# EAGLE design nahhhhh (EAGLE 9.6.2)
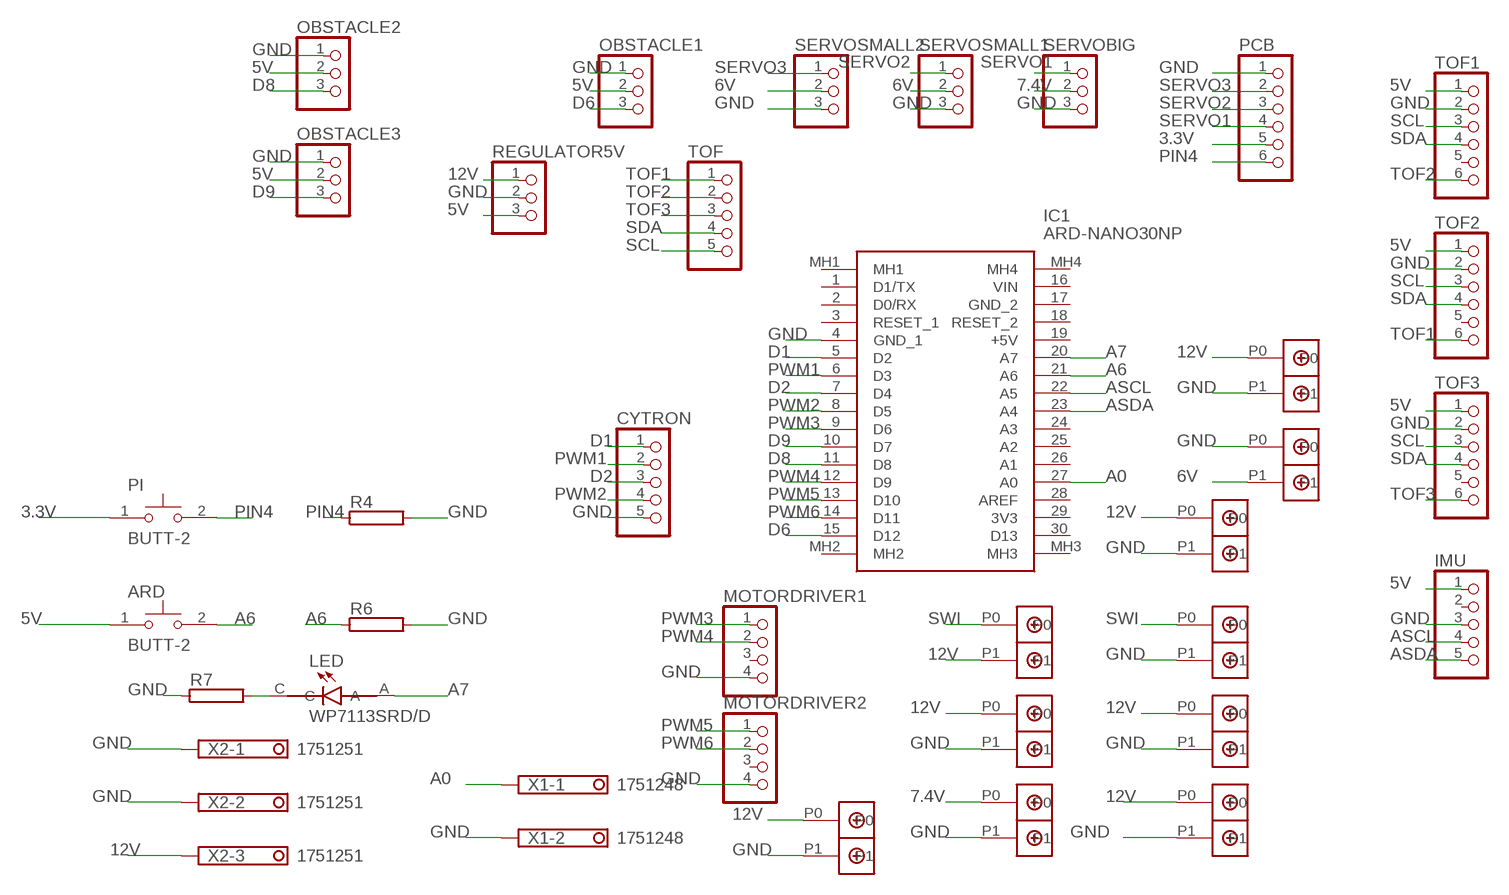
[diagram p0: schematic, sheet 1]

## Parts
ARD  BUTT-2  [SW_BUTT-2]
BATERY  DBCONN-1X2  [DBCONN-1X2]
BUCKSERVO  DBCONN-1X2  [DBCONN-1X2]
CYTRON  PINHD-1X5  [1X05]
CYTRONPOWER  DBCONN-1X2  [DBCONN-1X2]
IC1  ARD-NANO30NP  [ARDNANO30NP]
IMU  PINHD-1X5  [1X05]
LED  WP7113SRD/D  [LED_WP7113SRD/D]
LEDS  DBCONN-1X2  [DBCONN-1X2]
LEDS1  DBCONN-1X2  [DBCONN-1X2]
LEDS2  DBCONN-1X2  [DBCONN-1X2]
LEDS3  DBCONN-1X2  [DBCONN-1X2]
LEDS4  DBCONN-1X2  [DBCONN-1X2]
LEDS5  DBCONN-1X2  [DBCONN-1X2]
MOTORDRIVER1  PINHD-1X4  [1X04]
MOTORDRIVER2  PINHD-1X4  [1X04]
OBSTACLE1  PINHD-1X3  [1X03]
OBSTACLE2  PINHD-1X3  [1X03]
OBSTACLE3  PINHD-1X3  [1X03]
PCB  PINHD-1X6  [1X06]
PI  BUTT-2  [SW_BUTT-2]
R4  RHPS58  [HPS58]
R6  RHPS58  [HPS58]
R7  RHPS58  [HPS58]
REGULATOR5V  PINHD-1X3  [1X03]
SERVOBIG  PINHD-1X3  [1X03]
SERVOSMALL1  PINHD-1X3  [1X03]
SERVOSMALL2  PINHD-1X3  [1X03]
TOF  PINHD-1X5  [1X05]
TOF1  PINHD-1X6  [1X06]
TOF2  PINHD-1X6  [1X06]
TOF3  PINHD-1X6  [1X06]
U$1  DBCONN-1X2  [DBCONN-1X2]
X1  1751248  [1751248]
X2  1751251  [1751251]

## Nets
3.3V: PCB.5 PI.1
5V: ARD.1 IMU.1 OBSTACLE1.2 OBSTACLE2.2 OBSTACLE3.2 REGULATOR5V.3 TOF1.1 TOF2.1 TOF3.1
6V: LEDS5.P1 SERVOSMALL1.2 SERVOSMALL2.2
7.4V: SERVOBIG.2 U$1.P0
12V: BUCKSERVO.P0 CYTRONPOWER.P0 LEDS1.P1 LEDS2.P0 LEDS3.P0 LEDS4.P0 LEDS.P0 REGULATOR5V.1 X2.3
A0: IC1.27(A0) X1.1
A6: ARD.2 IC1.21(A6) R6.1
A7: IC1.20(A7) LED.A
ASCL: IC1.22(A5) IMU.4
ASDA: IC1.23(A4) IMU.5
D1: CYTRON.1 IC1.5(D2)
D2: CYTRON.3 IC1.7(D4)
D6: IC1.15(D12) OBSTACLE1.3
D8: IC1.11(D8) OBSTACLE2.3
D9: IC1.10(D7) OBSTACLE3.3
GND: BATERY.P1 BUCKSERVO.P1 CYTRON.5 CYTRONPOWER.P1 IC1.4(GND_1) IMU.3 LEDS2.P1 LEDS3.P1 LEDS4.P1 LEDS5.P0 LEDS.P1 MOTORDRIVER1.4 MOTORDRIVER2.4 OBSTACLE1.1 OBSTACLE2.1 OBSTACLE3.1 PCB.1 R4.2 R6.2 R7.1 REGULATOR5V.2 SERVOBIG.3 SERVOSMALL1.3 SERVOSMALL2.3 TOF1.2 TOF2.2 TOF3.2 U$1.P1 X1.2 X2.1 X2.2
N$2: LED.C R7.2
PIN4: PCB.6 PI.2 R4.1
PWM1: CYTRON.2 IC1.6(D3)
PWM2: CYTRON.4 IC1.8(D5)
PWM3: IC1.9(D6) MOTORDRIVER1.1
PWM4: IC1.12(D9) MOTORDRIVER1.2
PWM5: IC1.13(D10) MOTORDRIVER2.1
PWM6: IC1.14(D11) MOTORDRIVER2.2
SCL: TOF1.3 TOF2.3 TOF3.3 TOF.5
SDA: TOF1.4 TOF2.4 TOF3.4 TOF.4
SERVO1: PCB.4 SERVOBIG.1
SERVO2: PCB.3 SERVOSMALL1.1
SERVO3: PCB.2 SERVOSMALL2.1
SWI: BATERY.P0 LEDS1.P0
TOF1: TOF2.6 TOF.1
TOF2: TOF1.6 TOF.2
TOF3: TOF3.6 TOF.3
Unconnected: IC1.1(D1/TX) IC1.2(D0/RX) IC1.3(RESET_1) IC1.16(VIN) IC1.17(GND_2) IC1.18(RESET_2) IC1.19(+5V) IC1.24(A3) IC1.25(A2) IC1.26(A1) IC1.28(AREF) IC1.29(3V3) IC1.30(D13) IC1.MH1 IC1.MH2 IC1.MH3 IC1.MH4 IMU.2 MOTORDRIVER1.3 MOTORDRIVER2.3 TOF1.5 TOF2.5 TOF3.5

## Library data of the parts
ARD PI = BUTT-2:BUTT-2: Tactile Switches MINI PUSH BUTTON SWITCH 2-PIN QTY. 4 Check availability <https://pricing.snapeda.com/parts/BUTT-2/Gravitech/view-part?ref=eda>; AVAILABILITY: Not in stock; CHECK_PRICES: https://www.snapeda.com/parts/BUTT-2/Gravitech/view-part/?ref=eda; DESCRIPTION: Tactile Switches MINI PUSH BUTTON SWITCH 2-PIN QTY. 4; MF: Gravitech; MP: BUTT-2; PACKAGE: None; PRICE: None; SNAPEDA_LINK: https://www.snapeda.com/parts/BUTT-2/Gravitech/view-part/?ref=snap
BATERY BUCKSERVO CYTRONPOWER LEDS LEDS1-LEDS5 U$1 = Terminal Block Connector:DBCONN-1X2
CYTRON IMU TOF = pinhead:PINHD-1X5: PIN HEADER
IC1 = ARD-NANO30NP:ARD-NANO30NP: Development Boards & Kits - AVR Arduino Nano 3.1 W/ATMEGA328 NO-PIN Source: Datasheet <http://www.mouser.com/datasheet/2/595/Arduino_Nano3_0-220057.pdf>; DESCRIPTION: Development Boards & Kits - AVR Arduino Nano 3.1 W/ATMEGA328 NO-PIN; HEIGHT: 5mm; MANUFACTURER_NAME: Gravitech; MANUFACTURER_PART_NUMBER: ARD-NANO30NP; MOUSER_PART_NUMBER: 992-ARD-NANO30NP; MOUSER_PRICE-STOCK: https://www.mouser.co.uk/ProductDetail/Gravitech/ARD-NANO30NP?qs=Vxac6xGyzPlh7in3DWNTbQ%3D%3D
LED = WP7113SRD_D:WP7113SRD/D: Red T-1 3/4 5 mm 30° Tinted Diffused 600 mcd 1.85 V Solid State LED Through Hole Check availability <https://pricing.snapeda.com/parts/WP7113SRD/D/Kingbright/view-part?ref=eda>; AVAILABILITY: In Stock; CHECK_PRICES: https://www.snapeda.com/parts/WP7113SRD/D/Kingbright/view-part/?ref=eda; DESCRIPTION: Red 640nm LED Indication - Discrete 1.85V Radial; MF: Kingbright; MP: WP7113SRD/D; PACKAGE: Radial Kingbright; PRICE: None; SNAPEDA_LINK: https://www.snapeda.com/parts/WP7113SRD/D/Kingbright/view-part/?ref=snap
MOTORDRIVER1 MOTORDRIVER2 = pinhead:PINHD-1X4: PIN HEADER
OBSTACLE1-OBSTACLE3 REGULATOR5V SERVOBIG SERVOSMALL1 SERVOSMALL2 = pinhead:PINHD-1X3: PIN HEADER
PCB TOF1-TOF3 = pinhead:PINHD-1X6: PIN HEADER
R4 R6 R7 = resistor-power:R: Power Resitor; OC_FARNELL: unknown; OC_NEWARK: unknown
X1 = con-phoenix-350:1751248: MKDS 1/ 2-3,5 Printklemme Nennstrom: 10 A Bemessungsspannung: 160 V Raster: 3,5 mm Polzahl: 2 Montageart: Löten Anschlussart: Schraubanschluss Anschlussrichtung vom Leiter zur Platine: 0° Source: http://eshop.phoenixcontact.com .. 1751248.pdf; OC_FARNELL: unknown; OC_NEWARK: unknown
X2 = con-phoenix-350:1751251: MKDS 1/ 3-3,5 Printklemme Nennstrom: 10 A Bemessungsspannung: 160 V Raster: 3,5 mm Polzahl: 3 Montageart: Löten Anschlussart: Schraubanschluss Anschlussrichtung vom Leiter zur Platine: 0° Source: http://eshop.phoenixcontact.com .. 1751251.pdf; OC_FARNELL: unknown; OC_NEWARK: unknown

## Board
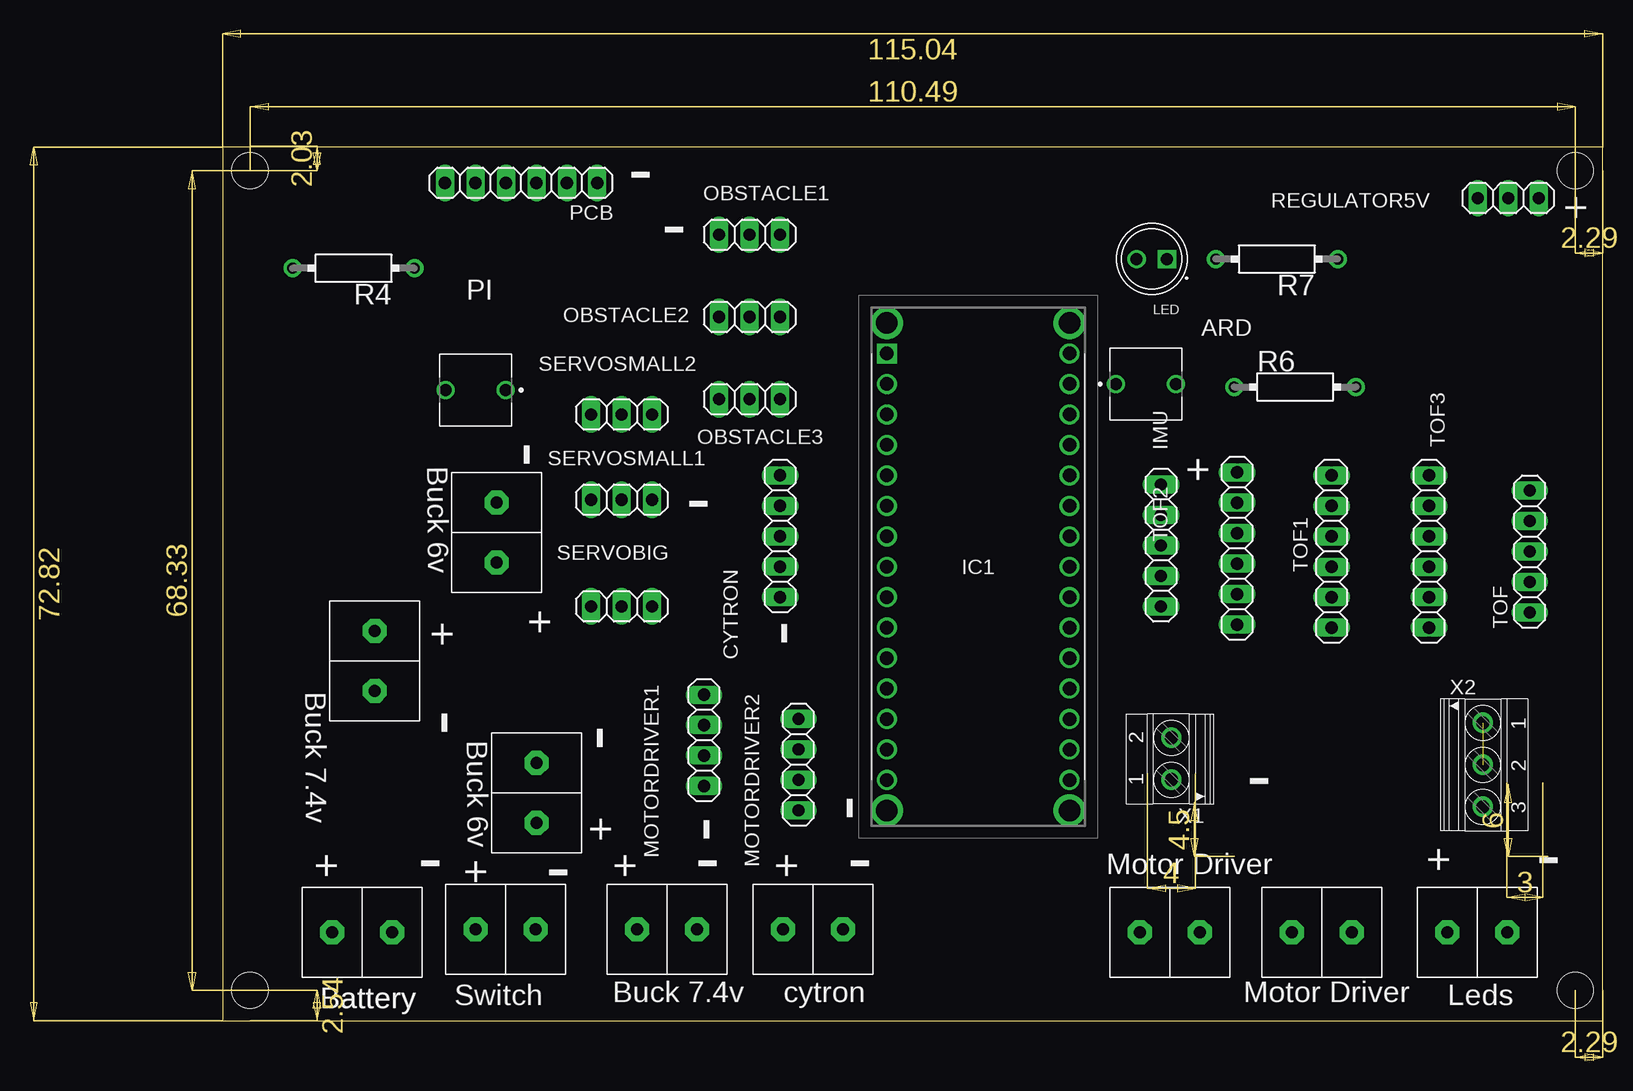
[diagram p1: board, top side]
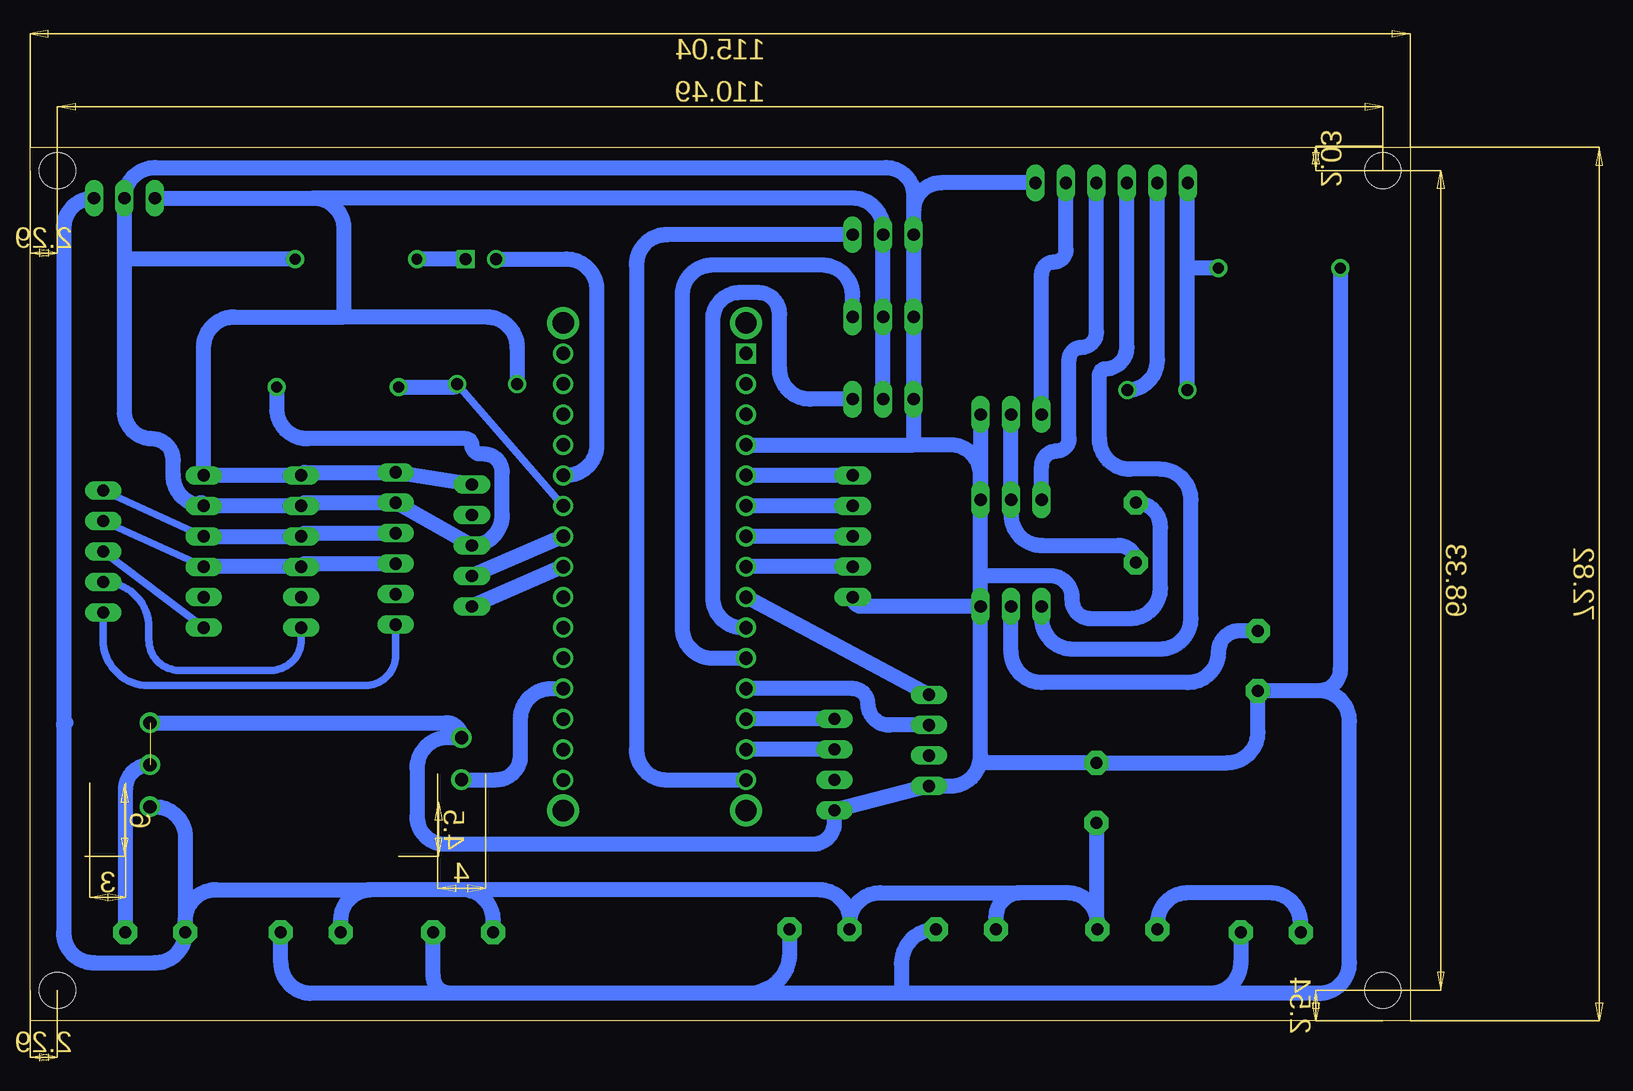
[diagram p2: board, bottom side, seen from below]

Size 115.04 x 72.82 mm. Coordinates in mm from the lower left corner, seen from the top.
Outline: 0,0 115.04,0 115.04,72.82 0,72.82 0,0
Copper layers (1*16): Top 0.035mm / dielectric 1.5mm / Bottom 0.035mm
Design rules "default": minimum track width 6mil, minimum drill 0.35mm, track to track 6mil, track to pad 6mil, pad to pad 6mil, via to via 6mil, smd to smd 6mil, copper to edge 40mil, drill to drill 6mil, minimum pad ring 10mil, minimum via ring 8mil, stop-mask expansion 4mil, vias tented up to drill 0mil, thermal gap 10mil
Holes 3 mm at 112.78,2.54 112.78,70.87 2.29,2.54 2.29,70.87

### Footprints (pad centres in the part's own frame; a part is rotated, then mirrored left to right if it is on the bottom)
SW_BUTT-2 = drill 1: 1 -2.5,0; 2 2.5,0
DBCONN-1X2 = drill 1 pad 2 octagon: P0 -2.54,0; P1 2.46,0
1X05 = drill 1.016 long: 1 -5.08,0; 2 -2.54,0; 3 0,0; 4 2.54,0; 5 5.08,0
ARDNANO30NP = drill 1.11 pad 1.665 square: 1 0,0 | drill 1.11 pad 1.665: 2 0,-2.54; 3 0,-5.08; 4 0,-7.62; 5 0,-10.16; 6 0,-12.7; 7 0,-15.24; 8 0,-17.78; 9 0,-20.32; 10 0,-22.86; 11 0,-25.4; 12 0,-27.94; 13 0,-30.48; 14 0,-33.02; 15 0,-35.56; 16 15.24,0; 17 15.24,-2.54; 18 15.24,-5.08; 19 15.24,-7.62; 20 15.24,-10.16; 21 15.24,-12.7; 22 15.24,-15.24; 23 15.24,-17.78; 24 15.24,-20.32; 25 15.24,-22.86; 26 15.24,-25.4; 27 15.24,-27.94; 28 15.24,-30.48; 29 15.24,-33.02; 30 15.24,-35.56 | drill 1.778 pad 2.667: MH1 0,2.54; MH2 0,-38.1; MH3 15.24,-38.1; MH4 15.24,2.54
LED_WP7113SRD/D = drill 1: A 1.27,0 | drill 1 square: C -1.27,0
1X04 = drill 1.016 long: 1 -3.81,0; 2 -1.27,0; 3 1.27,0; 4 3.81,0
1X03 = drill 1.016 long: 1 -2.54,0; 2 0,0; 3 2.54,0
1X06 = drill 1.016 long: 1 -6.35,0; 2 -3.81,0; 3 -1.27,0; 4 1.27,0; 5 3.81,0; 6 6.35,0
HPS58 = drill 0.9 pad 1.5: 1 -5.08,0; 2 5.08,0
1751248 = drill 1.1 pad 1.7: 1 -1.75,-0.1; 2 1.75,-0.1
1751251 = drill 1.1 pad 1.7: 1 -3.5,-0.1; 2 0,-0.1; 3 3.5,-0.1

### Placement (x,y rotation side)
ARD  76.96,53.09 0 top
BATERY  11.68,7.37 0 top
BUCKSERVO  104.65,7.37 0 top
CYTRON  46.48,40.39 270 top
CYTRONPOWER  49.28,7.62 0 top
IC1  55.37,55.63 0 top
IMU  78.23,39.62 270 top
LED  77.47,63.5 180 top
LEDS  37.08,7.62 0 top
LEDS1  23.62,7.62 0 top
LEDS2  91.69,7.37 0 top
LEDS3  78.99,7.37 0 top
LEDS4  26.16,19.05 90 top
LEDS5  22.86,40.64 270 top
MOTORDRIVER1  40.13,23.37 270 top
MOTORDRIVER2  48.01,21.34 270 top
OBSTACLE1  43.94,65.53 0 top
OBSTACLE2  43.94,58.67 0 top
OBSTACLE3  43.94,51.82 0 top
PCB  24.89,69.85 180 top
PI  21.08,52.58 180 top
R4  10.92,62.74 180 top
R6  89.41,52.83 0 top
R7  87.88,63.5 180 top
REGULATOR5V  107.19,68.58 180 top
SERVOBIG  33.27,34.54 0 top
SERVOSMALL1  33.27,43.43 0 top
SERVOSMALL2  33.27,50.55 0 top
TOF  108.97,39.12 90 top
TOF1  92.46,39.12 270 top
TOF2  84.58,39.37 270 top
TOF3  100.58,39.12 270 top
U$1  12.7,29.97 270 top
X1  78.99,21.84 90 top
X2  105.16,21.34 270 top

### Tracks (layer width: path | path; a pad name or v marks a point on that pad's centre or on a via)
3.3V
  Bottom 1.27: PI.1 arc-90 21.08,55.08 PCB.5
5V
  Bottom 1.27: 88.9,58.67 77,58.67 arc90 74.46,56.13 ARD.1 | REGULATOR5V.3 91.44,68.58 | 91.44,68.58 arc90 88.9,66.04 88.9,58.67 | OBSTACLE3.2 OBSTACLE2.2 OBSTACLE1.2 43.94,66.04 arc-90 46.48,68.58 91.44,68.58 | 88.9,58.67 98.04,58.67 arc-90 100.58,56.13 TOF3.1 TOF1.1 92.2,45.72 TOF2.1 IMU.1
6V
  Bottom 1.27: SERVOSMALL2.2 SERVOSMALL1.2 33.27,42.16 arc-90 30.73,39.62 24.3,39.62 arc90 LEDS5.P1
7.4V
  Bottom 1.27: U$1.P0 14.22,32.51 arc-90 16,30.73 arc90 18.54,28.19 30.73,28.19 arc90 33.27,30.73 SERVOBIG.2
12V
  Bottom 1.27: REGULATOR5V.1 arc-90 112.27,66.04 112.27,24.64 | 112.27,24.64 112.27,7.37 arc-90 109.73,4.83 104.65,4.83 arc-90 BUCKSERVO.P0 | LEDS2.P0 89.15,8.38 arc90 86.61,10.92 | BUCKSERVO.P0 102.11,8.38 arc90 99.57,10.92 86.61,10.92 | 112.07,24.84 arc-90 112.27,24.64 | X2.3 104.65,17.84 arc90 102.11,15.3 BUCKSERVO.P0 | LEDS3.P0 76.45,8.38 arc-90 78.99,10.92 | 78.99,10.92 86.61,10.92 | 78.99,10.92 49.28,10.92 arc90 46.74,8.38 CYTRONPOWER.P0 46.74,8.13 arc90 44.2,10.67 32.51,10.67 | 32.51,10.67 28.62,10.67 arc90 26.08,8.13 LEDS1.P1 arc90 26.16,7.7 LEDS4.P0 | 32.51,10.67 arc-90 34.54,8.64 LEDS.P0
A0
  Bottom 1.27: X1.1 76.17,20.09 arc-90 74.17,22.1 74.17,25.15 arc90 71.63,27.69 IC1.27
A6
  Bottom 0.61: ARD.2 IC1.21
  Bottom 1.27: R6.1 79.72,52.83 arc-90 ARD.2
A7
  Bottom 1.27: LED.A 70.36,63.5 arc90 67.82,60.96 67.82,48.01 arc90 70.36,45.47 IC1.20
ASCL
  Bottom 1.27: IC1.22 IMU.4
ASDA
  Bottom 1.27: IC1.23 IMU.5
D1
  Bottom 1.27: CYTRON.1 IC1.5
D2
  Bottom 1.27: CYTRON.3 IC1.7
D6
  Bottom 1.27: OBSTACLE1.3 61.98,65.53 arc-90 64.52,62.99 64.52,22.61 arc-90 61.98,20.07 IC1.15
D8
  Bottom 1.27: OBSTACLE2.3 46.48,60.45 arc-90 49.02,62.99 58.17,62.99 arc-90 60.71,60.45 60.71,32.77 arc-90 58.17,30.23 IC1.11
D9
  Bottom 1.27: OBSTACLE3.3 50.04,51.82 arc90 52.58,54.36 52.58,58.93 arc-90 54.36,60.71 55.88,60.71 arc-90 58.17,58.42 58.17,35.31 arc-90 55.63,32.77 IC1.10
GND  (1 unrouted)
  Bottom 1.27: IC1.4 41.4,48.01 | 41.4,48.01 OBSTACLE3.1 OBSTACLE2.1 OBSTACLE1.1 | TOF3.2 TOF1.2 92.2,43.18 TOF2.2 IMU.3 arc-90 75.69,42.16 75.69,45.72 arc-90 77.22,47.24 77.47,47.24 arc90 78.23,48.01 arc-90 78.74,48.51 91.95,48.51 arc90 94.49,51.05 R6.2 | 107.19,63.5 REGULATOR5V.2 arc90 104.65,71.12 43.69,71.12 arc90 41.4,68.83 OBSTACLE1.1 | R7.1 107.19,63.5 | 80.01,2.29 91.61,2.29 arc90 94.15,4.83 LEDS2.P1 | SERVOBIG.3 45.72,34.54 arc90 CYTRON.5 | SERVOBIG.3 35.81,37.08 | 35.81,37.08 SERVOSMALL1.3 | SERVOSMALL1.3 35.81,45.47 arc-90 38.35,48.01 41.4,48.01 | OBSTACLE1.1 41.4,66.8 | 100.84,43.18 arc90 TOF3.2 | 35.81,37.08 29.97,37.08 arc90 28.19,35.31 28.19,35.05 arc-90 26.67,33.53 23.37,33.53 arc-90 20.83,36.07 20.83,41.15 arc-90 LEDS5.P0 | SERVOSMALL2.3 SERVOSMALL1.3 | 80.01,2.29 arc90 81.45,3.73 LEDS3.P1 | X2.2 arc-90 107.11,19.28 BUCKSERVO.P1 | PCB.1 39.12,69.85 arc-90 41.4,67.56 OBSTACLE1.1 | BATERY.P1 14.14,4.83 arc90 16.68,2.29 | 16.68,2.29 42.42,2.29 | 42.42,2.29 55.12,2.29 | 55.12,2.29 80.01,2.29 | 16.68,2.29 7.62,2.29 arc-90 5.08,4.83 5.08,24.97 arc-90 7.62,27.51 | TOF3.2 arc90 103.12,45.47 103.12,46.74 arc-90 104.9,48.51 arc90 107.19,50.8 107.19,63.5 | X2.1 80.34,24.84 arc90 X1.2 80.26,23.59 arc-90 82.8,21.05 82.8,17.02 arc-90 80.52,14.73 49.78,14.73 arc-90 48.01,16.51 MOTORDRIVER2.4 MOTORDRIVER1.4 38.35,19.56 arc-90 35.81,22.1 | 35.81,22.1 SERVOBIG.3 | LEDS.P1 arc-90 42.42,4.75 42.42,2.29 | CYTRONPOWER.P1 51.74,5.67 arc90 55.12,2.29 | U$1.P1 12.7,24.05 arc90 15.24,21.51 LEDS4.P1 35.23,21.51 arc90 35.81,22.1 | 10.67,27.51 U$1.P1 | 7.62,27.51 U$1.P1 | R4.2 5.84,29.29 arc90 7.62,27.51
N$2
  Bottom 1.27: LED.C R7.2
PIN4
  Bottom 1.27: PI.2 18.58,62.48 | 18.58,62.48 18.58,69.81 arc90 PCB.6 | R4.1 18.33,62.74 arc-90 18.58,62.48
PWM1
  Bottom 1.27: CYTRON.2 IC1.6
PWM2
  Bottom 1.27: CYTRON.4 IC1.8
PWM3
  Bottom 1.27: MOTORDRIVER1.1 IC1.9
PWM4
  Bottom 1.27: MOTORDRIVER1.2 43.43,24.64 arc90 45.21,26.42 arc-90 46.48,27.69 IC1.12
PWM5
  Bottom 1.27: MOTORDRIVER2.1 IC1.13
PWM6
  Bottom 1.27: MOTORDRIVER2.2 IC1.14
SCL
  Bottom 0.61: TOF3.3 TOF.5
  Bottom 1.27: TOF3.3 TOF1.3 92.2,40.64 TOF2.3
SDA
  Bottom 0.61: TOF.4 TOF3.4
  Bottom 1.27: TOF2.4 92.2,38.1 TOF1.4 TOF3.4
SERVO1
  Bottom 1.27: 30.73,33.78 SERVOBIG.1 30.73,33.53 arc-90 28.19,30.99 20.83,30.99 arc-90 18.29,33.53 18.29,43.43 arc-90 20.83,45.97 23.37,45.97 arc90 25.91,48.51 25.91,53.85 arc90 25.4,54.36 arc-90 23.62,56.13 PCB.4
SERVO2
  Bottom 1.27: SERVOSMALL1.1 30.73,46.23 arc90 29.46,47.5 | 29.46,47.5 arc-90 28.45,48.51 | 29.46,47.5 arc-90 28.45,48.51 | PCB.3 26.16,57.4 arc90 27.43,56.13 arc-90 28.45,55.12 28.45,48.51
SERVO3
  Bottom 1.27: SERVOSMALL2.1 30.73,62.23 arc90 29.72,63.25 arc-90 28.7,64.26 PCB.2
SWI
  Bottom 1.27: BATERY.P0 9.14,8.13 arc-90 11.68,10.67 18.54,10.67 arc-90 21.08,8.13 LEDS1.P0
TOF1
  Bottom 0.61: TOF.1 108.97,31.75 arc-90 105.16,27.94 87.12,27.94 arc-90 84.58,30.48 TOF2.6
TOF2
  Bottom 0.61: TOF.2 arc90 105.16,32.77 105.16,31.75 arc-90 102.62,29.21 95,29.21 arc-90 92.46,31.75 TOF1.6
TOF3
  Bottom 0.61: TOF3.6 TOF.3

### Text on the board
tNames: - | + | - | - | Buck 6v | + | - | + | + | - | Buck 7.4v | - | - | Buck 6v | - | - | + | - | + | - | + | - | + | - | Motor Driver | + | - | + | - | Switch | Buck 7.4v | cytron | Motor Driver | Leds | Battery | Battery